# Altium project NXP_FRDM_IMX93.PrjPcb (part 2 of 13)

## Sheet E-05 LPDDR4_x.SchDoc: FRDM-IMX93
size 513 x 386 mm; DrawnBy: FORLINX; Organization: ORGANIZATION; Address1: ADDRESS 1; Address2: ADDRESS 2; Address3: ADDRESS 3; Address4: ADDRESS 4; Revision: -; ENG_APP_DATE: --/--/--; DSN_APP_DATE: --/--/--; CHK_APP_DATE: --/--/--; Classification: Public, Company Internal/Proprietary, Company Confidential,  Company Secret; Page Create Date: March  8, 1995; OrgName: NXP Semiconductor; FIUO: A; OrgAddr1: NO. 192 Liangjing Rd. Pudong New Area, ShangHai; Page Number: 5; PageTitle: LPDDR4/x; Page Size: C; Page Count: 23; Designer: FORLINX; RevCode: B1; Approver: NXP SE; Doc: SCH-94611 PDF: SPF-94611; DsnPath: T:\FILES\Designs\Single Board Computers\i.MX93-FRDM\Design Files\SCH-94611_B1.DSN; SchematicName: FRDM-i.MX 93 Development Board; PageName: E-05 LPDDR4/x; PageSize: C; TopSchematic: True
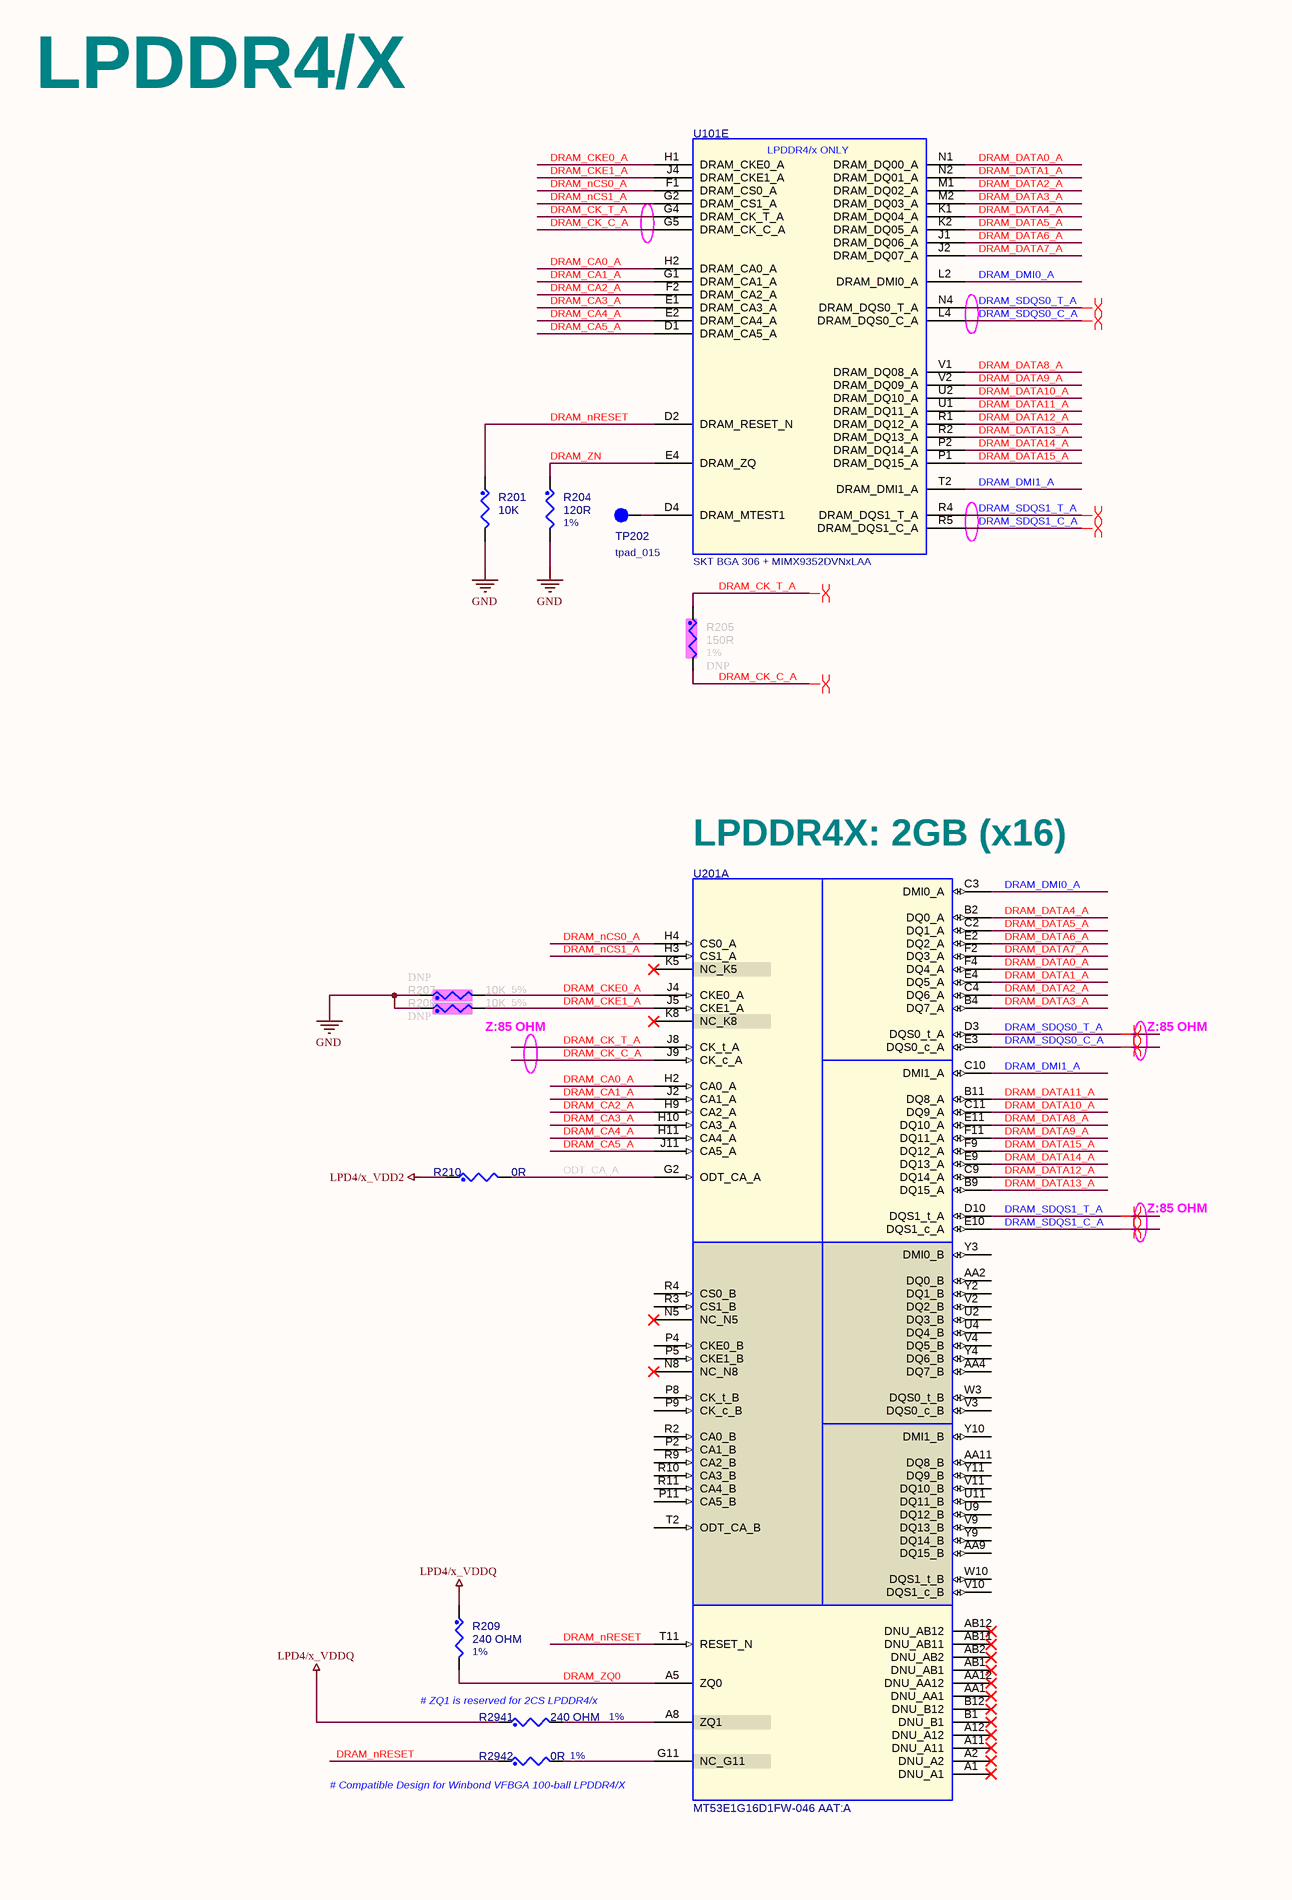
[diagram p9: E-05 LPDDR4_x.SchDoc, left]
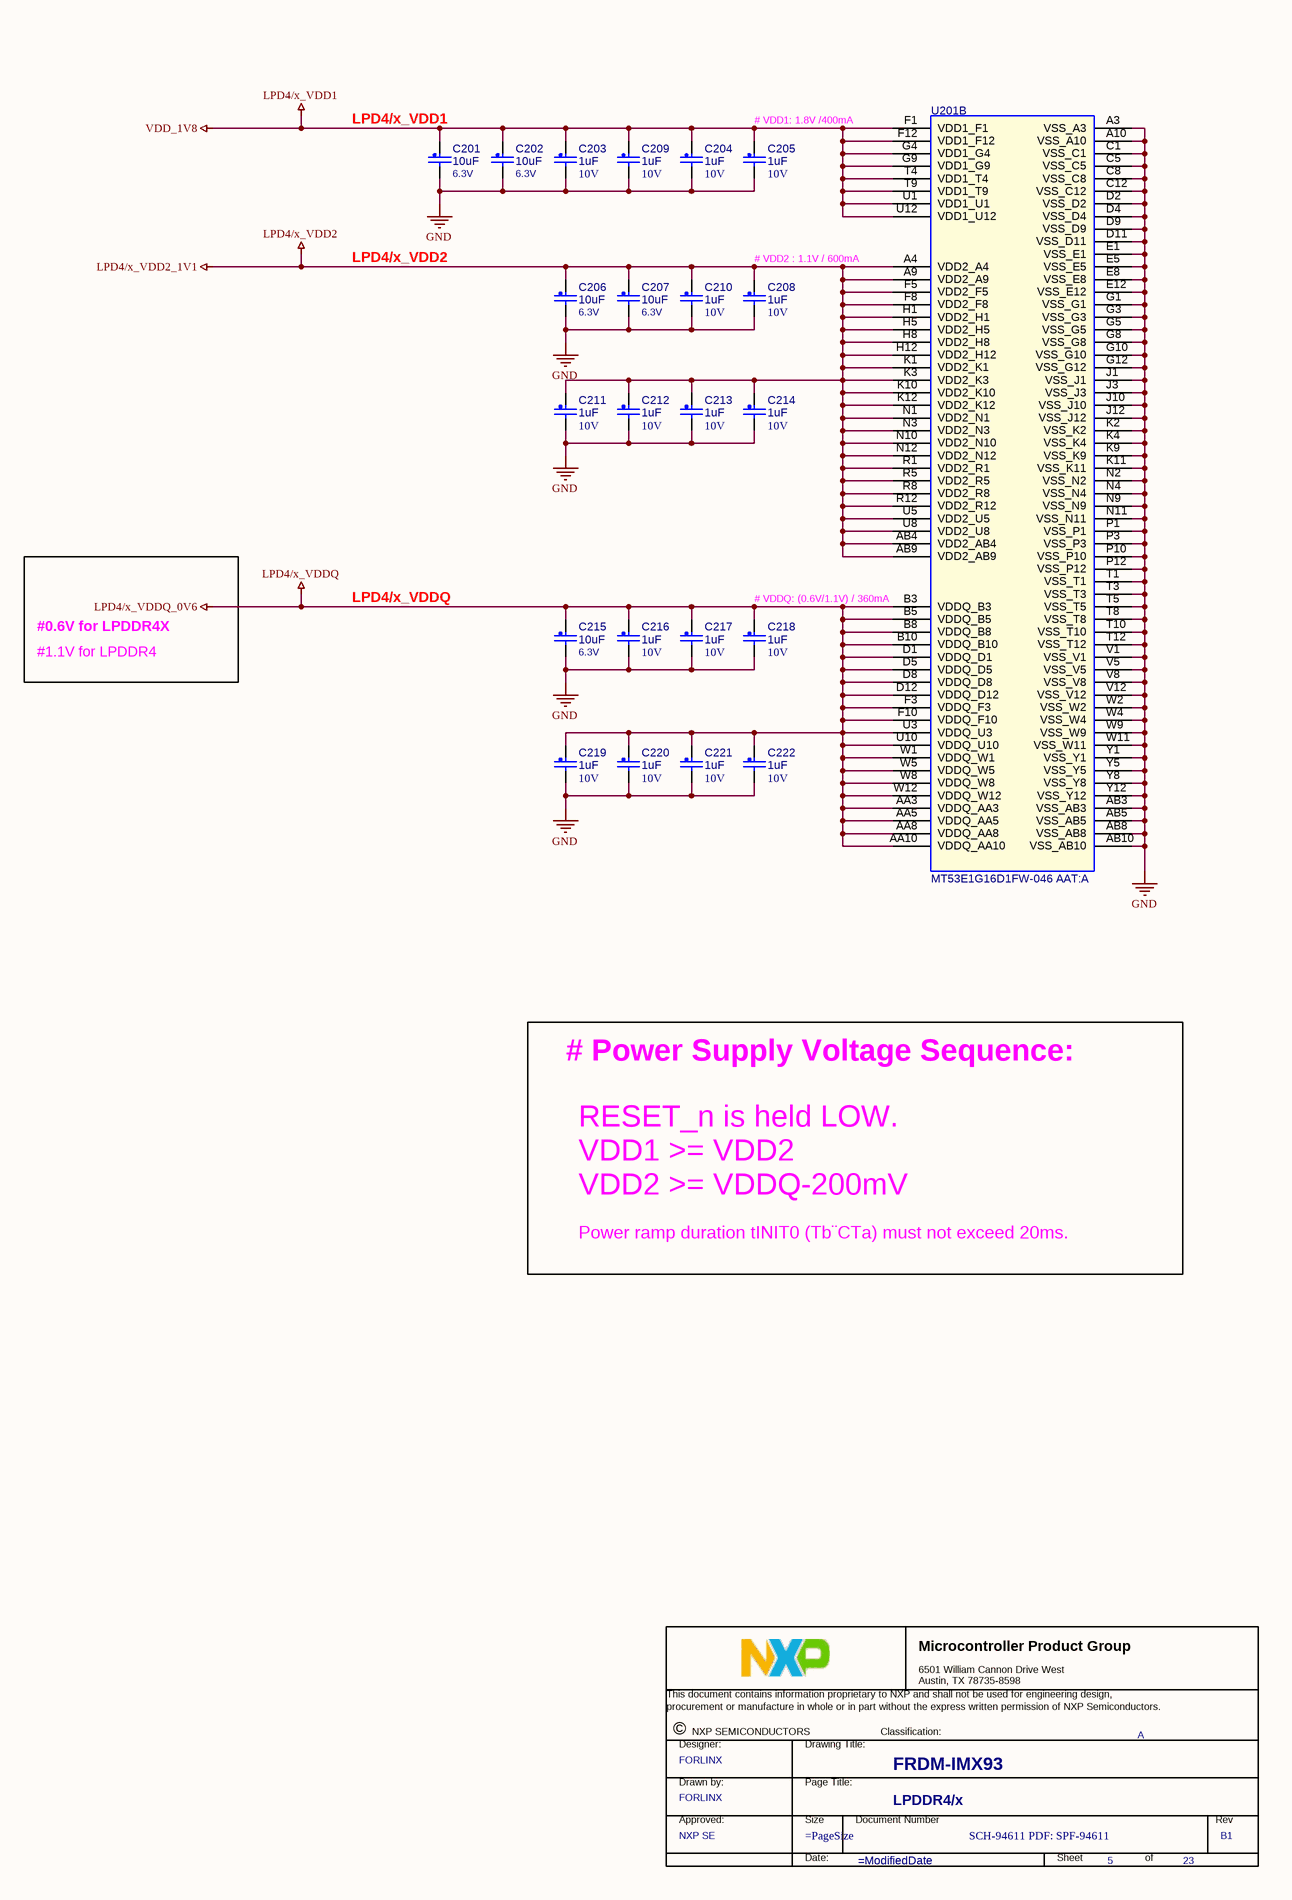
[diagram p10: E-05 LPDDR4_x.SchDoc, right]

### Parts
(Parts that share a designator on the sheet are numbered #1, #2 ... from top to bottom, then left to right.)
*#5  Title: FRDM-IMX93  RevCode: B1  PageTitle: LPDDR4/x  Page Number: 5  Page Count: 23  DrawnBy: FORLINX  Doc: SCH-94611 PDF: SPF-94611  Approver: NXP SE  FIUO: A  (graphical)
C201  10uF  VOLTAGE: 6.3V  [C0402]
C202  10uF  VOLTAGE: 6.3V  [C0402]
C203  1uF  VOLTAGE: 10V  [C0201]
C204  1uF  VOLTAGE: 10V  [C0201]
C205  1uF  VOLTAGE: 10V  [C0201]
C206  10uF  VOLTAGE: 6.3V  [C0402]
C207  10uF  VOLTAGE: 6.3V  [C0402]
C208  1uF  VOLTAGE: 10V  [C0201]
C209  1uF  VOLTAGE: 10V  [C0201]
C210  1uF  VOLTAGE: 10V  [C0201]
C211  1uF  VOLTAGE: 10V  [C0201]
C212  1uF  VOLTAGE: 10V  [C0201]
C213  1uF  VOLTAGE: 10V  [C0201]
C214  1uF  VOLTAGE: 10V  [C0201]
C215  10uF  VOLTAGE: 6.3V  [C0402]
C216  1uF  VOLTAGE: 10V  [C0201]
C217  1uF  VOLTAGE: 10V  [C0201]
C218  1uF  VOLTAGE: 10V  [C0201]
C219  1uF  VOLTAGE: 10V  [C0201]
C220  1uF  VOLTAGE: 10V  [C0201]
C221  1uF  VOLTAGE: 10V  [C0201]
C222  1uF  VOLTAGE: 10V  [C0201]
R201  10K  [R0402]
R204  120R  Tolerance: 1%  [R0402]
R205  150R  ASSY_OPT: DNP  Tolerance: 1%  [R0402]
R207  10K  ASSY_OPT: DNP  Tolerance: 5%  [R0402]
R208  10K  ASSY_OPT: DNP  Tolerance: 5%  [R0402]
R209  240 OHM  Tolerance: 1%  [R0201]
R210  0R  [R0402]
R2941  240 OHM  Tolerance: 1%  [R0201]
R2942  0R  Tolerance: 1%  [R0201]
TP202  TPAD_015  [tpad_015]
U101  SKT BGA 306 + MIMX9352DVNxLAA  [skt_bga306_0p5_sq16p23_elast_nsp]  (part E of 6)
U201  MT53E1G16D1FW-046 AAT:A  [bga200_0p65x0p8_10x14p5]  (parts A,B of 2)

### Nets
GND: C201.2 C202.2 C203.2 C204.2 C205.2 C206.2 C207.2 C208.2 C209.2 C210.2 C211.2 C212.2 C213.2 C214.2 C215.2 C216.2 C217.2 C218.2 C219.2 C220.2 C221.2 C222.2 R201.2 R204.2 R207.1 R208.1 U201.A3(VSS_A3) U201.A10(VSS_A10) U201.AB3(VSS_AB3) U201.AB5(VSS_AB5) U201.AB8(VSS_AB8) U201.AB10(VSS_AB10) U201.C1(VSS_C1) U201.C5(VSS_C5) U201.C8(VSS_C8) U201.C12(VSS_C12) U201.D2(VSS_D2) U201.D4(VSS_D4) U201.D9(VSS_D9) U201.D11(VSS_D11) U201.E1(VSS_E1) U201.E5(VSS_E5) U201.E8(VSS_E8) U201.E12(VSS_E12) U201.G1(VSS_G1) U201.G3(VSS_G3) U201.G5(VSS_G5) U201.G8(VSS_G8) U201.G10(VSS_G10) U201.G12(VSS_G12) U201.J1(VSS_J1) U201.J3(VSS_J3) U201.J10(VSS_J10) U201.J12(VSS_J12) U201.K2(VSS_K2) U201.K4(VSS_K4) U201.K9(VSS_K9) U201.K11(VSS_K11) U201.N2(VSS_N2) U201.N4(VSS_N4) U201.N9(VSS_N9) U201.N11(VSS_N11) U201.P1(VSS_P1) U201.P3(VSS_P3) U201.P10(VSS_P10) U201.P12(VSS_P12) U201.T1(VSS_T1) U201.T3(VSS_T3) U201.T5(VSS_T5) U201.T8(VSS_T8) U201.T10(VSS_T10) U201.T12(VSS_T12) U201.V1(VSS_V1) U201.V5(VSS_V5) U201.V8(VSS_V8) U201.V12(VSS_V12) U201.W2(VSS_W2) U201.W4(VSS_W4) U201.W9(VSS_W9) U201.W11(VSS_W11) U201.Y1(VSS_Y1) U201.Y5(VSS_Y5) U201.Y8(VSS_Y8) U201.Y12(VSS_Y12)
LPD4/x_VDD1: C201.1 C202.1 C203.1 C204.1 C205.1 C209.1 U201.F1(VDD1_F1) U201.F12(VDD1_F12) U201.G4(VDD1_G4) U201.G9(VDD1_G9) U201.T4(VDD1_T4) U201.T9(VDD1_T9) U201.U1(VDD1_U1) U201.U12(VDD1_U12)  [also labelled VDD_1V8]
LPD4/x_VDD2: C206.1 C207.1 C208.1 C210.1 C211.1 C212.1 C213.1 C214.1 R210.1 U201.A4(VDD2_A4) U201.A9(VDD2_A9) U201.AB4(VDD2_AB4) U201.AB9(VDD2_AB9) U201.F5(VDD2_F5) U201.F8(VDD2_F8) U201.H1(VDD2_H1) U201.H5(VDD2_H5) U201.H8(VDD2_H8) U201.H12(VDD2_H12) U201.K1(VDD2_K1) U201.K3(VDD2_K3) U201.K10(VDD2_K10) U201.K12(VDD2_K12) U201.N1(VDD2_N1) U201.N3(VDD2_N3) U201.N10(VDD2_N10) U201.N12(VDD2_N12) U201.R1(VDD2_R1) U201.R5(VDD2_R5) U201.R8(VDD2_R8) U201.R12(VDD2_R12) U201.U5(VDD2_U5) U201.U8(VDD2_U8)  [also labelled LPD4/x_VDD2_1V1]
LPD4/x_VDDQ: C215.1 C216.1 C217.1 C218.1 C219.1 C220.1 C221.1 C222.1 R209.1 R2941.1 U201.AA3(VDDQ_AA3) U201.AA5(VDDQ_AA5) U201.AA8(VDDQ_AA8) U201.AA10(VDDQ_AA10) U201.B3(VDDQ_B3) U201.B5(VDDQ_B5) U201.B8(VDDQ_B8) U201.B10(VDDQ_B10) U201.D1(VDDQ_D1) U201.D5(VDDQ_D5) U201.D8(VDDQ_D8) U201.D12(VDDQ_D12) U201.F3(VDDQ_F3) U201.F10(VDDQ_F10) U201.U3(VDDQ_U3) U201.U10(VDDQ_U10) U201.W1(VDDQ_W1) U201.W5(VDDQ_W5) U201.W8(VDDQ_W8) U201.W12(VDDQ_W12)  [also labelled LPD4/x_VDDQ_0V6]
DRAM_CA0_A: U101.H2(DRAM_CA0_A) U201.H2(CA0_A)
DRAM_CA1_A: U101.G1(DRAM_CA1_A) U201.J2(CA1_A)
DRAM_CA2_A: U101.F2(DRAM_CA2_A) U201.H9(CA2_A)
DRAM_CA3_A: U101.E1(DRAM_CA3_A) U201.H10(CA3_A)
DRAM_CA4_A: U101.E2(DRAM_CA4_A) U201.H11(CA4_A)
DRAM_CA5_A: U101.D1(DRAM_CA5_A) U201.J11(CA5_A)
DRAM_CK_C_A: R205.2 U101.G5(DRAM_CK_C_A) U201.J9(CK_c_A)
DRAM_CK_T_A: R205.1 U101.G4(DRAM_CK_T_A) U201.J8(CK_t_A)
DRAM_CKE0_A: R207.2 U101.H1(DRAM_CKE0_A) U201.J4(CKE0_A)
DRAM_CKE1_A: R208.2 U101.J4(DRAM_CKE1_A) U201.J5(CKE1_A)
DRAM_DATA0_A: U101.N1(DRAM_DQ00_A) U201.F4(DQ4_A)
DRAM_DATA1_A: U101.N2(DRAM_DQ01_A) U201.E4(DQ5_A)
DRAM_DATA2_A: U101.M1(DRAM_DQ02_A) U201.C4(DQ6_A)
DRAM_DATA3_A: U101.M2(DRAM_DQ03_A) U201.B4(DQ7_A)
DRAM_DATA4_A: U101.K1(DRAM_DQ04_A) U201.B2(DQ0_A)
DRAM_DATA5_A: U101.K2(DRAM_DQ05_A) U201.C2(DQ1_A)
DRAM_DATA6_A: U101.J1(DRAM_DQ06_A) U201.E2(DQ2_A)
DRAM_DATA7_A: U101.J2(DRAM_DQ07_A) U201.F2(DQ3_A)
DRAM_DATA8_A: U101.V1(DRAM_DQ08_A) U201.E11(DQ10_A)
DRAM_DATA9_A: U101.V2(DRAM_DQ09_A) U201.F11(DQ11_A)
DRAM_DATA10_A: U101.U2(DRAM_DQ10_A) U201.C11(DQ9_A)
DRAM_DATA11_A: U101.U1(DRAM_DQ11_A) U201.B11(DQ8_A)
DRAM_DATA12_A: U101.R1(DRAM_DQ12_A) U201.C9(DQ14_A)
DRAM_DATA13_A: U101.R2(DRAM_DQ13_A) U201.B9(DQ15_A)
DRAM_DATA14_A: U101.P2(DRAM_DQ14_A) U201.E9(DQ13_A)
DRAM_DATA15_A: U101.P1(DRAM_DQ15_A) U201.F9(DQ12_A)
DRAM_DMI0_A: U101.L2(DRAM_DMI0_A) U201.C3(DMI0_A)
DRAM_DMI1_A: U101.T2(DRAM_DMI1_A) U201.C10(DMI1_A)
DRAM_nCS0_A: U101.F1(DRAM_CS0_A) U201.H4(CS0_A)
DRAM_nCS1_A: U101.G2(DRAM_CS1_A) U201.H3(CS1_A)
DRAM_nRESET: R201.1 R2942.1 U101.D2(DRAM_RESET_N) U201.T11(RESET_N)
DRAM_SDQS0_C_A: U101.L4(DRAM_DQS0_C_A) U201.E3(DQS0_c_A)
DRAM_SDQS0_T_A: U101.N4(DRAM_DQS0_T_A) U201.D3(DQS0_t_A)
DRAM_SDQS1_C_A: U101.R5(DRAM_DQS1_C_A) U201.E10(DQS1_c_A)
DRAM_SDQS1_T_A: U101.R4(DRAM_DQS1_T_A) U201.D10(DQS1_t_A)
DRAM_ZN: R204.1 U101.E4(DRAM_ZQ)
DRAM_ZQ0: R209.2 U201.A5(ZQ0)
ODT_CA_A: R210.2 U201.G2(ODT_CA_A)
NetR2941_2: R2941.2 U201.A8(ZQ1)
NetR2942_2: R2942.2 U201.G11(NC_G11)
NetTP202_1: TP202.1(Pin1) U101.D4(DRAM_MTEST1)

Not connected (* = marked no-connect by the designer): U201 A1(DNU_A1)* A2(DNU_A2)* A11(DNU_A11)* A12(DNU_A12)* AA1(DNU_AA1)* AA2(DQ0_B) AA4(DQ7_B) AA9(DQ15_B) AA11(DQ8_B) AA12(DNU_AA12)* AB1(DNU_AB1)* AB2(DNU_AB2)* AB11(DNU_AB11)* AB12(DNU_AB12)* B1(DNU_B1)* B12(DNU_B12)* K5(NC_K5)* K8(NC_K8)* N5(NC_N5)* N8(NC_N8)* P2(CA1_B) P4(CKE0_B) P5(CKE1_B) P8(CK_t_B) P9(CK_c_B) P11(CA5_B) R2(CA0_B) R3(CS1_B) R4(CS0_B) R9(CA2_B) R10(CA3_B) R11(CA4_B) T2(ODT_CA_B) U2(DQ3_B) U4(DQ4_B) U9(DQ12_B) U11(DQ11_B) V2(DQ2_B) V3(DQS0_c_B) V4(DQ5_B) V9(DQ13_B) V10(DQS1_c_B) V11(DQ10_B) W3(DQS0_t_B) W10(DQS1_t_B) Y2(DQ1_B) Y3(DMI0_B) Y4(DQ6_B) Y9(DQ14_B) Y10(DMI1_B) Y11(DQ9_B)

### Layout directives
differential pair: DRAM_CK_C_A, DRAM_CK_T_A, DRAM_SDQS0_C_A, DRAM_SDQS0_T_A, DRAM_SDQS1_C_A, DRAM_SDQS1_T_A

### Notes on the sheet
- LPDDR4/X
- (near C205) # VDD1: 1.8V /400mA
- (near C208) # VDD2 : 1.1V / 600mA
- #0.6V for LPDDR4X
- # VDDQ: (0.6V/1.1V) / 360mA
- #1.1V for LPDDR4
- (near U201) LPDDR4X: 2GB (x16)
- Z:85 OHM
- # Power Supply Voltage Sequence:
- RESET_n is held LOW.
  VDD1 >= VDD2
  VDD2 >= VDDQ-200mV
- Power ramp duration tINIT0 (Tb¨CTa) must not exceed 20ms.
- (near R2941) # ZQ1 is reserved for 2CS LPDDR4/x
- (near R2942) # Compatible Design for Winbond VFBGA 100-ball LPDDR4/X
- DWG. NO.
- REV.
- SHT.
- REVISION
- DESCRIPTION
- DATE
- APPROVED
- ENG:
- APPROVALS
- quilter.ai <http://quilter.ai>
- DSN:
- CHK:
- REFERENCE DOCUMENTS
- TITLE
- PROJECT
- BOM:
- FAB DWG:
- PCB DWG:
- ASSY DWG:
- SIZE
- FILE NAME
- C
- DWG NO.
- SHEET
- OF
- REV
- (in symbol MIMX9352DVNxLAA, part E) LPDDR4/x ONLY
- (in symbol TitleBlock_MCPG) Microcontroller Product Group; 6501 William Cannon Drive West / Austin, TX 78735-8598; This document contains information proprietary to NXP and shall not be used for engineering design,; procurement or manufacture in whole or in part without the express written permission of NXP Semiconductors.; ©; NXP SEMICONDUCTORS; Classification:; Designer:; Drawing Title:; Drawn by:; Page Title:; Approved:; Size; Document Number; Rev; Date:; Sheet; of

### Library data of the parts
*#5 = TitleBlock_MCPG: Classification: Public, Company Internal/Proprietary, Company Confidential,  Company Secret; OrgName: NXP Semiconductor; OrgAddr1: NO. 192 Liangjing Rd. Pudong New Area, ShangHai; Page Size: =PageSize; Page Create Date: March  8, 1995; Designer: FORLINX; Page Modify Date: =ModifiedDate
C201 = CAP_NP: 0402,10uF,6.3V,+/-20%,X5R; Part Reference: C201; CLASS: DISCRETE; FPLIST: CC0402_25,CC0402_HD,0402_CC; CAD_APPROVED: Yes; MFG_PN01: 0402X106M6R3NT; MFG_NAME01: FENGHUA; Tolerance: 20%; Value: 10uF; PCB Footprint: C0402; HEIGHT: 0.65 MM; ROHS: Yes
C202 = CAP_NP: 0402,10uF,6.3V,+/-20%,X5R; Part Reference: C202; CLASS: DISCRETE; FPLIST: CC0402_25,CC0402_HD,0402_CC; CAD_APPROVED: Yes; MFG_PN01: 0402X106M6R3NT; MFG_NAME01: FENGHUA; Tolerance: 20%; Value: 10uF; PCB Footprint: C0402; HEIGHT: 0.65 MM; ROHS: Yes
C203 = CAP_NP: 0201,1uF,10V,+/-20%,X5R; Part Reference: C203; CLASS: DISCRETE; FPLIST: CC0201,CC0201_HD,0201_CC,cc_0201_cir; CAD_APPROVED: Yes; MFG_PN01: CL03A105MP3NSNC; MFG_NAME01: SAMSUNG; Tolerance: 10%; Temp Range: -55¡ãC to 85¡ãC; Value: 1uF; PCB Footprint: C0201; Package Type: SMD/SMT; Package Size: 0201 (0603 Metric); HEIGHT: 0.35MM; ROHS: Yes
C204 = CAP_NP: 0201,1uF,10V,+/-20%,X5R; Part Reference: C204; CLASS: DISCRETE; Tolerance: 10%; MFG_NAME01: SAMSUNG; MFG_PN01: CL03A105MP3NSNC; CAD_APPROVED: Yes; FPLIST: CC0201,CC0201_HD,0201_CC,cc_0201_cir; Temp Range: -55¡ãC to 85¡ãC; Value: 1uF; PCB Footprint: C0201; Package Type: SMD/SMT; Package Size: 0201 (0603 Metric); ROHS: Yes; HEIGHT: 0.35MM
C205 = CAP_NP: 0201,1uF,10V,+/-20%,X5R; Part Reference: C205; CLASS: DISCRETE; FPLIST: CC0201,CC0201_HD,0201_CC,cc_0201_cir; CAD_APPROVED: Yes; MFG_PN01: CL03A105MP3NSNC; MFG_NAME01: SAMSUNG; Tolerance: 10%; Temp Range: -55¡ãC to 85¡ãC; Value: 1uF; PCB Footprint: C0201; Package Type: SMD/SMT; Package Size: 0201 (0603 Metric); HEIGHT: 0.35MM; ROHS: Yes
C206 = CAP_NP: 0402,10uF,6.3V,+/-20%,X5R; Part Reference: C206; CLASS: DISCRETE; FPLIST: CC0402_25,CC0402_HD,0402_CC; CAD_APPROVED: Yes; MFG_PN01: 0402X106M6R3NT; MFG_NAME01: FENGHUA; Tolerance: 20%; Value: 10uF; PCB Footprint: C0402; HEIGHT: 0.65 MM; ROHS: Yes
C207 = CAP_NP: 0402,10uF,6.3V,+/-20%,X5R; Part Reference: C207; CLASS: DISCRETE; FPLIST: CC0402_25,CC0402_HD,0402_CC; CAD_APPROVED: Yes; MFG_PN01: 0402X106M6R3NT; MFG_NAME01: FENGHUA; Tolerance: 20%; Value: 10uF; PCB Footprint: C0402; HEIGHT: 0.65 MM; ROHS: Yes
C208 = CAP_NP: 0201,1uF,10V,+/-20%,X5R; Part Reference: C208; CLASS: DISCRETE; Tolerance: 10%; MFG_NAME01: SAMSUNG; MFG_PN01: CL03A105MP3NSNC; CAD_APPROVED: Yes; FPLIST: CC0201,CC0201_HD,0201_CC,cc_0201_cir; Temp Range: -55¡ãC to 85¡ãC; Value: 1uF; PCB Footprint: C0201; Package Type: SMD/SMT; Package Size: 0201 (0603 Metric); ROHS: Yes; HEIGHT: 0.35MM
C209 = CAP_NP: 0201,1uF,10V,+/-20%,X5R; Part Reference: C209; CLASS: DISCRETE; Tolerance: 10%; MFG_NAME01: SAMSUNG; MFG_PN01: CL03A105MP3NSNC; CAD_APPROVED: Yes; FPLIST: CC0201,CC0201_HD,0201_CC,cc_0201_cir; Temp Range: -55¡ãC to 85¡ãC; Value: 1uF; PCB Footprint: C0201; Package Type: SMD/SMT; Package Size: 0201 (0603 Metric); ROHS: Yes; HEIGHT: 0.35MM
C210 = CAP_NP: 0201,1uF,10V,+/-20%,X5R; Part Reference: C210; CLASS: DISCRETE; Tolerance: 10%; MFG_NAME01: SAMSUNG; MFG_PN01: CL03A105MP3NSNC; CAD_APPROVED: Yes; FPLIST: CC0201,CC0201_HD,0201_CC,cc_0201_cir; Temp Range: -55¡ãC to 85¡ãC; Value: 1uF; PCB Footprint: C0201; Package Type: SMD/SMT; Package Size: 0201 (0603 Metric); ROHS: Yes; HEIGHT: 0.35MM
C211 = CAP_NP: 0201,1uF,10V,+/-20%,X5R; Part Reference: C211; CLASS: DISCRETE; FPLIST: CC0201,CC0201_HD,0201_CC,cc_0201_cir; CAD_APPROVED: Yes; MFG_PN01: CL03A105MP3NSNC; MFG_NAME01: SAMSUNG; Tolerance: 10%; Temp Range: -55¡ãC to 85¡ãC; Value: 1uF; PCB Footprint: C0201; Package Type: SMD/SMT; Package Size: 0201 (0603 Metric); HEIGHT: 0.35MM; ROHS: Yes
C212 = CAP_NP: 0201,1uF,10V,+/-20%,X5R; Part Reference: C212; CLASS: DISCRETE; FPLIST: CC0201,CC0201_HD,0201_CC,cc_0201_cir; CAD_APPROVED: Yes; MFG_PN01: CL03A105MP3NSNC; MFG_NAME01: SAMSUNG; Tolerance: 10%; Temp Range: -55¡ãC to 85¡ãC; Value: 1uF; PCB Footprint: C0201; Package Type: SMD/SMT; Package Size: 0201 (0603 Metric); HEIGHT: 0.35MM; ROHS: Yes
C213 = CAP_NP: 0201,1uF,10V,+/-20%,X5R; Part Reference: C213; CLASS: DISCRETE; FPLIST: CC0201,CC0201_HD,0201_CC,cc_0201_cir; CAD_APPROVED: Yes; MFG_PN01: CL03A105MP3NSNC; MFG_NAME01: SAMSUNG; Tolerance: 10%; Temp Range: -55¡ãC to 85¡ãC; Value: 1uF; PCB Footprint: C0201; Package Type: SMD/SMT; Package Size: 0201 (0603 Metric); HEIGHT: 0.35MM; ROHS: Yes
C214 = CAP_NP: 0201,1uF,10V,+/-20%,X5R; Part Reference: C214; CLASS: DISCRETE; Tolerance: 10%; MFG_NAME01: SAMSUNG; MFG_PN01: CL03A105MP3NSNC; CAD_APPROVED: Yes; FPLIST: CC0201,CC0201_HD,0201_CC,cc_0201_cir; Temp Range: -55¡ãC to 85¡ãC; Value: 1uF; PCB Footprint: C0201; Package Type: SMD/SMT; Package Size: 0201 (0603 Metric); ROHS: Yes; HEIGHT: 0.35MM
C215 = CAP_NP: 0402,10uF,6.3V,+/-20%,X5R; Part Reference: C215; CLASS: DISCRETE; FPLIST: CC0402_25,CC0402_HD,0402_CC; CAD_APPROVED: Yes; MFG_PN01: 0402X106M6R3NT; MFG_NAME01: FENGHUA; Tolerance: 20%; Value: 10uF; PCB Footprint: C0402; HEIGHT: 0.65 MM; ROHS: Yes
C216 = CAP_NP: 0201,1uF,10V,+/-20%,X5R; Part Reference: C216; CLASS: DISCRETE; FPLIST: CC0201,CC0201_HD,0201_CC,cc_0201_cir; CAD_APPROVED: Yes; MFG_PN01: CL03A105MP3NSNC; MFG_NAME01: SAMSUNG; Tolerance: 10%; Temp Range: -55¡ãC to 85¡ãC; Value: 1uF; PCB Footprint: C0201; Package Type: SMD/SMT; Package Size: 0201 (0603 Metric); HEIGHT: 0.35MM; ROHS: Yes
C217 = CAP_NP: 0201,1uF,10V,+/-20%,X5R; Part Reference: C217; CLASS: DISCRETE; Tolerance: 10%; MFG_NAME01: SAMSUNG; MFG_PN01: CL03A105MP3NSNC; CAD_APPROVED: Yes; FPLIST: CC0201,CC0201_HD,0201_CC,cc_0201_cir; Temp Range: -55¡ãC to 85¡ãC; Value: 1uF; PCB Footprint: C0201; Package Type: SMD/SMT; Package Size: 0201 (0603 Metric); ROHS: Yes; HEIGHT: 0.35MM
C218 = CAP_NP: 0201,1uF,10V,+/-20%,X5R; Part Reference: C218; CLASS: DISCRETE; FPLIST: CC0201,CC0201_HD,0201_CC,cc_0201_cir; CAD_APPROVED: Yes; MFG_PN01: CL03A105MP3NSNC; MFG_NAME01: SAMSUNG; Tolerance: 10%; Temp Range: -55¡ãC to 85¡ãC; Value: 1uF; PCB Footprint: C0201; Package Type: SMD/SMT; Package Size: 0201 (0603 Metric); HEIGHT: 0.35MM; ROHS: Yes
C219 = CAP_NP: 0201,1uF,10V,+/-20%,X5R; Part Reference: C219; CLASS: DISCRETE; Tolerance: 10%; MFG_NAME01: SAMSUNG; MFG_PN01: CL03A105MP3NSNC; CAD_APPROVED: Yes; FPLIST: CC0201,CC0201_HD,0201_CC,cc_0201_cir; Temp Range: -55¡ãC to 85¡ãC; Value: 1uF; PCB Footprint: C0201; ROHS: Yes; HEIGHT: 0.35MM; Package Size: 0201 (0603 Metric); Package Type: SMD/SMT
C220 = CAP_NP: 0201,1uF,10V,+/-20%,X5R; Part Reference: C220; CLASS: DISCRETE; FPLIST: CC0201,CC0201_HD,0201_CC,cc_0201_cir; CAD_APPROVED: Yes; MFG_PN01: CL03A105MP3NSNC; MFG_NAME01: SAMSUNG; Tolerance: 10%; Temp Range: -55¡ãC to 85¡ãC; Value: 1uF; PCB Footprint: C0201; HEIGHT: 0.35MM; ROHS: Yes; Package Size: 0201 (0603 Metric); Package Type: SMD/SMT
C221 = CAP_NP: 0201,1uF,10V,+/-20%,X5R; Part Reference: C221; CLASS: DISCRETE; Tolerance: 10%; MFG_NAME01: SAMSUNG; MFG_PN01: CL03A105MP3NSNC; CAD_APPROVED: Yes; FPLIST: CC0201,CC0201_HD,0201_CC,cc_0201_cir; Temp Range: -55¡ãC to 85¡ãC; Value: 1uF; PCB Footprint: C0201; ROHS: Yes; HEIGHT: 0.35MM; Package Size: 0201 (0603 Metric); Package Type: SMD/SMT
C222 = CAP_NP: 0201,1uF,10V,+/-20%,X5R; Part Reference: C222; CLASS: DISCRETE; FPLIST: CC0201,CC0201_HD,0201_CC,cc_0201_cir; CAD_APPROVED: Yes; MFG_PN01: CL03A105MP3NSNC; MFG_NAME01: SAMSUNG; Tolerance: 10%; Temp Range: -55¡ãC to 85¡ãC; Value: 1uF; PCB Footprint: C0201; HEIGHT: 0.35MM; ROHS: Yes; Package Size: 0201 (0603 Metric); Package Type: SMD/SMT
R201 = RES: 0402,10K,+/-1%; Part Reference: R201; CLASS: DISCRETE; FPLIST: RC0402_25,RC0402_HD,0402_CC; CAD_APPROVED: Yes; MFG_PN01: RC-02W1002FT; MFG_NAME01: FENGHUA; Tolerance: 5%; Value: 10K; PCB Footprint: R0402; HEIGHT: 0.4 MM; ROHS: Yes
R204 = RES: 0402,120Ohm,+/-1%; Part Reference: R204; CLASS: DISCRETE; FPLIST: RC0402_25,RC0402_HD,0402_CC; CAD_APPROVED: Yes; VOLTAGE: 1/10W; Temp Range: -55¡ãC ~ 155¡ãC; MFG_NAME01: FENGHUA; MFG_PN01: RC-02K1200FT; Value: 120R; PCB Footprint: R0402; HEIGHT: 0.4MM; ROHS: Yes
R205 = RES: 0402,150Ohm,+/-5%; Part Reference: R205; CLASS: DISCRETE; FPLIST: RC0402_25,RC0402_HD,0402_CC; CAD_APPROVED: Yes; MFG_PN01: RC-02W151JT; MFG_NAME01: FENGHUA; Value: 150R; PCB Footprint: R0402; HEIGHT: 0.4MM; ROHS: Yes
R207 = RES: 0402,10K,+/-1%; Part Reference: R207; CLASS: DISCRETE; FPLIST: RC0402_25,RC0402_HD,0402_CC; CAD_APPROVED: Yes; MFG_PN01: RC-02W1002FT; MFG_NAME01: FENGHUA; Value: 10K; PCB Footprint: R0402; ROHS: Yes; HEIGHT: 0.4 MM
R208 = RES: 0402,10K,+/-1%; Part Reference: R208; CLASS: DISCRETE; MFG_NAME01: FENGHUA; MFG_PN01: RC-02W1002FT; CAD_APPROVED: Yes; FPLIST: RC0402_25,RC0402_HD,0402_CC; Value: 10K; PCB Footprint: R0402; HEIGHT: 0.4 MM; ROHS: Yes
R209 = RES: 0201,240Ohm,+/-1%; Part Reference: R209; CLASS: DISCRETE; Temp Range: -55¡ãC ~ 125¡ãC; VOLTAGE: 25V; FPLIST: CC0201,CC0201_HD,0201_CC; CAD_APPROVED: Yes; MFG_PN01: RC-01W2400FT; MFG_NAME01: FENGHUA; Value: 240 OHM; PCB Footprint: R0201; HEIGHT: 0.26MM; Temp_Range: -55¡ãC ~ 125¡ãC; ROHS: Yes
R210 = RES: 0402,0Ohm,+/-1%; Part Reference: R210; CLASS: DISCRETE; VOLTAGE: 1/16W; Tolerance: 5%; MFG_NAME01: FENGHUA; MFG_PN01: RC-02000FT; CAD_APPROVED: Yes; FPLIST: RC0402_25,RC0402_HD,RC0402_X2,0402_CC; Value: 0R; PCB Footprint: R0402; ROHS: Yes; HEIGHT: 0.45 MM
R2941 = RES: 0201,240Ohm,+/-1%; Part Reference: R2941; CLASS: DISCRETE; MFG_NAME01: FENGHUA; MFG_PN01: RC-01W2400FT; Temp_Range: -55¡ãC ~ 125¡ãC; CAD_APPROVED: Yes; FPLIST: CC0201,CC0201_HD,0201_CC; VOLTAGE: 25V; Value: 240 OHM; PCB Footprint: R0201; ROHS: Yes; HEIGHT: 0.26MM; Temp Range: -55¡ãC ~ 125¡ãC
R2942 = RES: 0201,0Ohm,+/-5%; Part Reference: R2942; CLASS: DISCRETE; MFG_NAME01: FENGHUA; MFG_PN01: RC-01000JT; Temp_Range: -55¡ãC ~ 125¡ãC; CAD_APPROVED: Yes; FPLIST: CC0201,CC0201_HD,0201_CC; VOLTAGE: 25V; Value: 0R; PCB Footprint: R0201; ROHS: Yes; HEIGHT: 0.26MM; Temp Range: -55¡ãC ~ 125¡ãC
TP202 = TESTLOOP: no part to order; Part Reference: TP202; CLASS: IO; ASSY_OPT: DNP; CAD_APPROVED: Yes; MFG_PN01: NOT A COMPONENT; PCB Footprint: tpad_015; HEIGHT: 0.1MM; ROHS: Yes; MFG_NAME01: NOT A COMPONENT
U101 = MIMX9352DVNxLAA: MIMX9352CVVXMAB,-40~105+C,11*11mm,0.5mm pitch,FCBGA,A,306pin,1.7GHz; Part Reference: U101; CLASS: IC; FPLIST: skt_bga306_0p5_sq16p23_elast,skt_bga306_0p5_sq16p23_elast_nsp; CAD_APPROVED: Yes; MFG_NAME01: NXP SEMICONDUCTORS; Value: SKT BGA 306 + MIMX9352DVNxLAA; PCB Footprint: skt_bga306_0p5_sq16p23_elast_nsp; HEIGHT: 10.03MM; ROHS: Yes; MFG_PN01: MIMX9352DVNxLAA
U201 = MT53B768M32D4NQ_200P: MT53E1G16D1ZW-046 WT:C,200-ball TFBGA,10x14.5,LPDDR4/LPDDR4x,2GB,-25+C~85+C,code:D8FCP; Part Reference: U201; CLASS: IC; SPLIT_INST: TRUE; SWAP_INFO: (S1+S2); MFG_NAME01: MICRON; Temp_Range: -40C to +105C¡ãC; PRE_APN: 334-77894; CAD_APPROVED: Yes; VOLTAGE: 1.1V; Value: MT53E1G16D1FW-046 AAT:A; MFG_PN01: MT53E1G16D1ZW-046 WT:C; ROHS: Yes; HEIGHT: 0.95MM; Temp Range: -40C to +105C¡ãC; PCB Footprint: bga200_0p65x0p8_10x14p5

## Sheet E-06 CPU IO_PHY.SchDoc: FRDM-IMX93
size 513 x 386 mm; DrawnBy: FORLINX; Organization: ORGANIZATION; Address1: ADDRESS 1; Address2: ADDRESS 2; Address3: ADDRESS 3; Address4: ADDRESS 4; Revision: -; ENG_APP_DATE: --/--/--; DSN_APP_DATE: --/--/--; CHK_APP_DATE: --/--/--; Classification: Public, Company Internal/Proprietary, Company Confidential,  Company Secret; Page Create Date: March  8, 1995; OrgName: NXP Semiconductor; FIUO: A; OrgAddr1: NO. 192 Liangjing Rd. Pudong New Area, ShangHai; Page Number: 6; PageTitle: CPU IO/PHY; Page Size: C; Page Count: 23; Designer: FORLINX; RevCode: B1; Approver: NXP SE; Doc: SCH-94611 PDF: SPF-94611; DsnPath: T:\FILES\Designs\Single Board Computers\i.MX93-FRDM\Design Files\SCH-94611_B1.DSN; SchematicName: FRDM-i.MX 93 Development Board; PageName: E-06 CPU IO/PHY; PageSize: C; TopSchematic: True
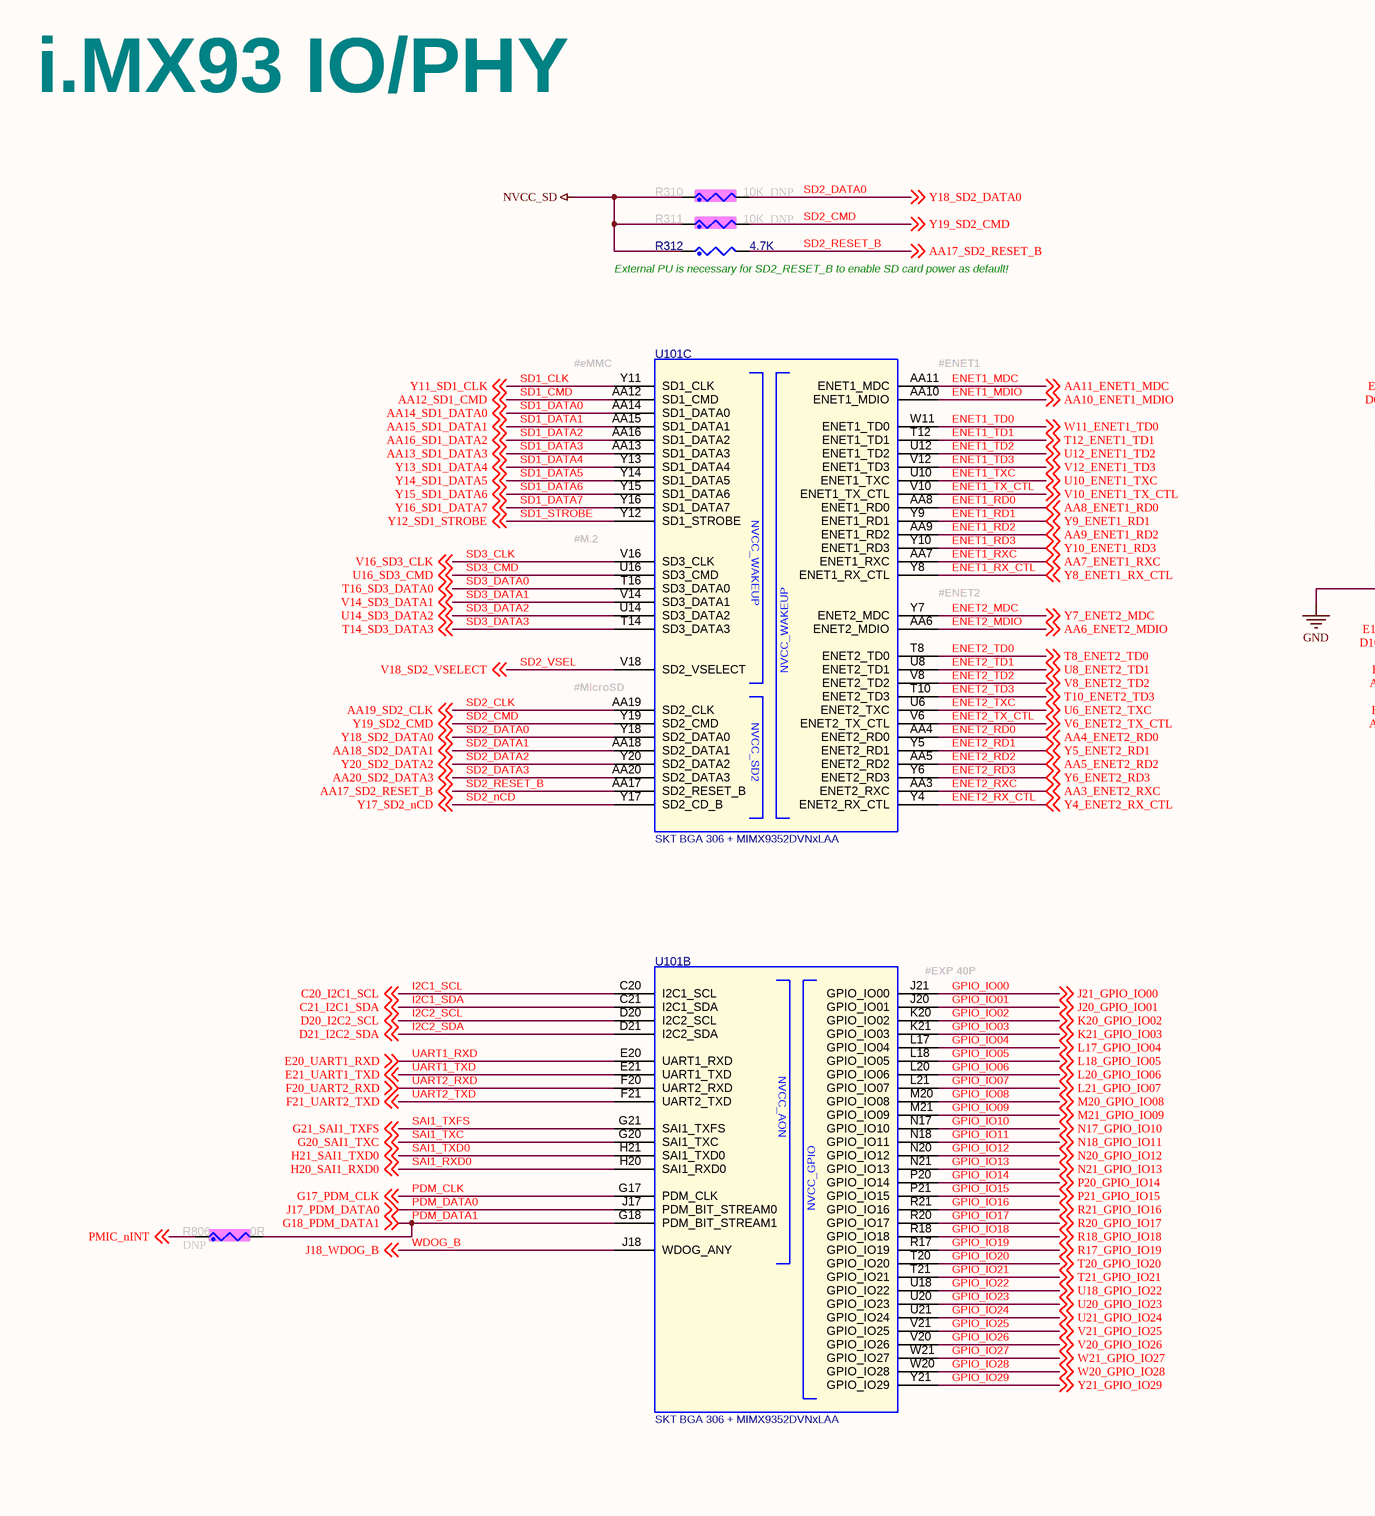
[diagram p11: E-06 CPU IO_PHY.SchDoc, left]
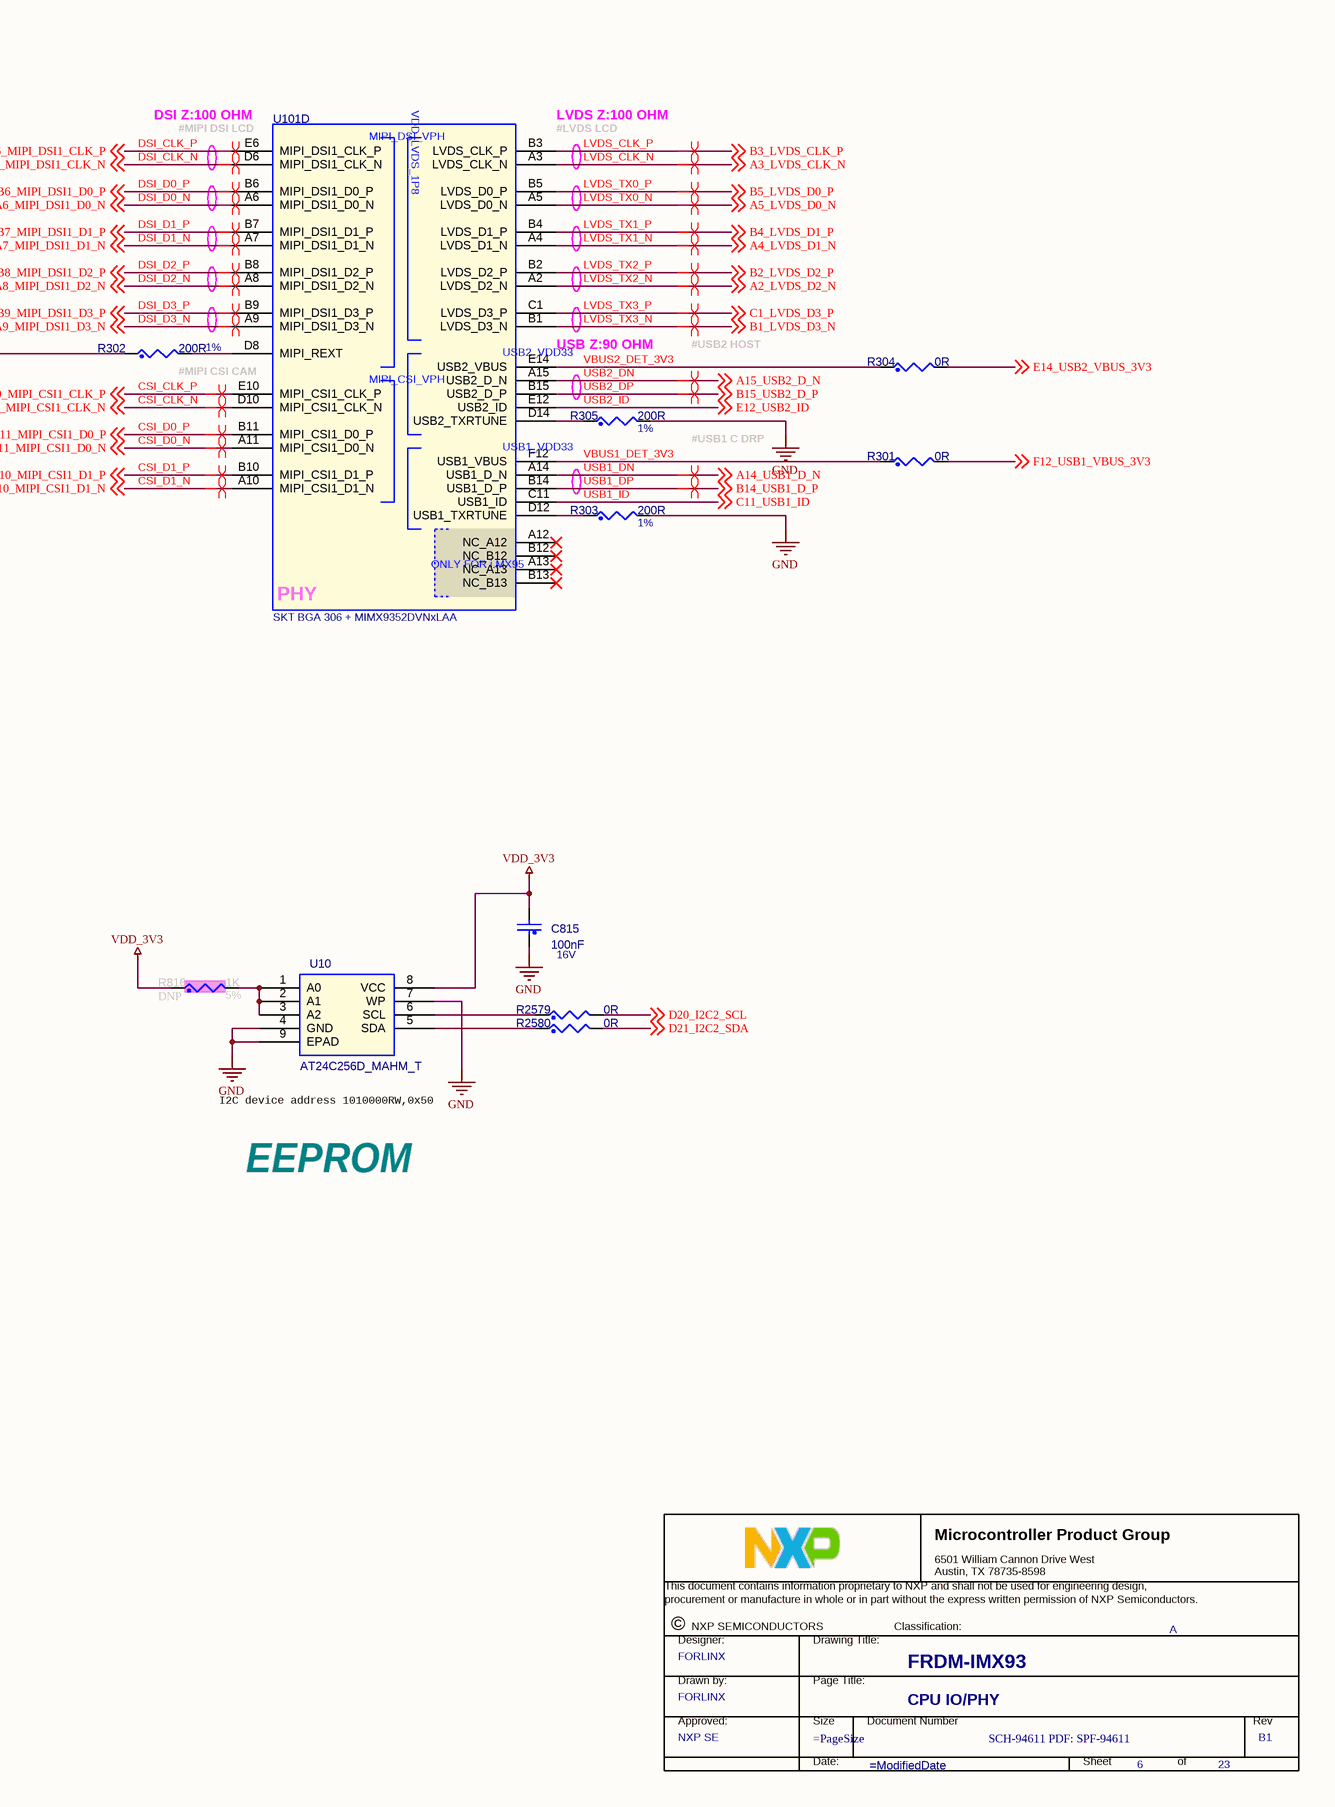
[diagram p12: E-06 CPU IO_PHY.SchDoc, right]

### Parts
(Parts that share a designator on the sheet are numbered #1, #2 ... from top to bottom, then left to right.)
*#6  Title: FRDM-IMX93  RevCode: B1  PageTitle: CPU IO/PHY  Page Number: 6  Page Count: 23  DrawnBy: FORLINX  Doc: SCH-94611 PDF: SPF-94611  Approver: NXP SE  FIUO: A  (graphical)
C815  100nF  VOLTAGE: 16V  [C0402]
R301  0R  [R0201]
R302  200R  Tolerance: 1%  [R0201]
R303  200R  Tolerance: 1%  [R0201]
R304  0R  [R0201]
R305  200R  Tolerance: 1%  [R0201]
R310  10K  ASSY_OPT: DNP  [R0402]
R311  10K  ASSY_OPT: DNP  [R0402]
R312  4.7K  [R0402]
R806  0R  ASSY_OPT: DNP  [R0201]
R816  1K  ASSY_OPT: DNP  Tolerance: 5%  [R0402]
R2579  0R  [R0402]
R2580  0R  [R0402]
U10  AT24C256D_MAHM_T  [UDFN-8P]
U101  SKT BGA 306 + MIMX9352DVNxLAA  [skt_bga306_0p5_sq16p23_elast_nsp]  (parts B,C,D of 6)

### Nets
GND: C815.1 R302.1 R303.2 R305.2 U10.4(GND) U10.7(WP) U10.9(EPAD)
NVCC_SD: R310.1 R311.1 R312.1
VDD_3V3: C815.2 R816.1 U10.8(VCC)
A14_USB1_D_N: U101.A14(USB1_D_N) ; off-sheet A14_USB1_D_N  [also labelled USB1_DN]  [project net USB1_DM]
AA3_ENET2_RXC: U101.AA3(ENET2_RXC) ; off-sheet AA3_ENET2_RXC  [also labelled ENET2_RXC]  [project net ENET2_PHYAD1]
AA5_ENET2_RD2: U101.AA5(ENET2_RD2) ; off-sheet AA5_ENET2_RD2  [also labelled ENET2_RD2]  [project net ENET2_MODE1]
AA7_ENET1_RXC: U101.AA7(ENET1_RXC) ; off-sheet AA7_ENET1_RXC  [also labelled ENET1_RXC]  [project net ENET1_PHYAD1]
AA9_ENET1_RD2: U101.AA9(ENET1_RD2) ; off-sheet AA9_ENET1_RD2  [also labelled ENET1_RD2]  [project net ENET1_MODE1]
CSI_CLK_N: U101.D10(MIPI_CSI1_CLK_N) ; off-sheet D10_MIPI_CSI1_CLK_N  [also labelled D10_MIPI_CSI1_CLK_N]
CSI_CLK_P: U101.E10(MIPI_CSI1_CLK_P) ; off-sheet E10_MIPI_CSI1_CLK_P  [also labelled E10_MIPI_CSI1_CLK_P]
CSI_D0_N: U101.A11(MIPI_CSI1_D0_N) ; off-sheet A11_MIPI_CSI1_D0_N  [also labelled A11_MIPI_CSI1_D0_N]
CSI_D0_P: U101.B11(MIPI_CSI1_D0_P) ; off-sheet B11_MIPI_CSI1_D0_P  [also labelled B11_MIPI_CSI1_D0_P]
CSI_D1_N: U101.A10(MIPI_CSI1_D1_N) ; off-sheet A10_MIPI_CSI1_D1_N  [also labelled A10_MIPI_CSI1_D1_N]
CSI_D1_P: U101.B10(MIPI_CSI1_D1_P) ; off-sheet B10_MIPI_CSI1_D1_P  [also labelled B10_MIPI_CSI1_D1_P]
DSI_CLK_N: U101.D6(MIPI_DSI1_CLK_N) ; off-sheet D6_MIPI_DSI1_CLK_N  [also labelled D6_MIPI_DSI1_CLK_N]
DSI_CLK_P: U101.E6(MIPI_DSI1_CLK_P) ; off-sheet E6_MIPI_DSI1_CLK_P  [also labelled E6_MIPI_DSI1_CLK_P]
DSI_D0_N: U101.A6(MIPI_DSI1_D0_N) ; off-sheet A6_MIPI_DSI1_D0_N  [also labelled A6_MIPI_DSI1_D0_N]
DSI_D0_P: U101.B6(MIPI_DSI1_D0_P) ; off-sheet B6_MIPI_DSI1_D0_P  [also labelled B6_MIPI_DSI1_D0_P]
DSI_D1_N: U101.A7(MIPI_DSI1_D1_N) ; off-sheet A7_MIPI_DSI1_D1_N  [also labelled A7_MIPI_DSI1_D1_N]
DSI_D1_P: U101.B7(MIPI_DSI1_D1_P) ; off-sheet B7_MIPI_DSI1_D1_P  [also labelled B7_MIPI_DSI1_D1_P]
DSI_D2_N: U101.A8(MIPI_DSI1_D2_N) ; off-sheet A8_MIPI_DSI1_D2_N  [also labelled A8_MIPI_DSI1_D2_N]
DSI_D2_P: U101.B8(MIPI_DSI1_D2_P) ; off-sheet B8_MIPI_DSI1_D2_P  [also labelled B8_MIPI_DSI1_D2_P]
DSI_D3_N: U101.A9(MIPI_DSI1_D3_N) ; off-sheet A9_MIPI_DSI1_D3_N  [also labelled A9_MIPI_DSI1_D3_N]
DSI_D3_P: U101.B9(MIPI_DSI1_D3_P) ; off-sheet B9_MIPI_DSI1_D3_P  [also labelled B9_MIPI_DSI1_D3_P]
E14_USB2_VBUS_3V3: R304.2 ; off-sheet E14_USB2_VBUS_3V3
E21_UART1_TXD: U101.E21(UART1_TXD) ; off-sheet E21_UART1_TXD  [also labelled UART1_TXD]  [project net #BOOT_MODE0]
ENET1_MDC: U101.AA11(ENET1_MDC) ; off-sheet AA11_ENET1_MDC  [also labelled AA11_ENET1_MDC]
ENET1_MDIO: U101.AA10(ENET1_MDIO) ; off-sheet AA10_ENET1_MDIO  [also labelled AA10_ENET1_MDIO]
ENET1_RD0: U101.AA8(ENET1_RD0) ; off-sheet AA8_ENET1_RD0  [also labelled AA8_ENET1_RD0]
ENET1_RD1: U101.Y9(ENET1_RD1) ; off-sheet Y9_ENET1_RD1  [also labelled Y9_ENET1_RD1]  [project net ENET1_MODE0]
ENET1_RD3: U101.Y10(ENET1_RD3) ; off-sheet Y10_ENET1_RD3  [also labelled Y10_ENET1_RD3]  [project net ENET1_MODE2]
ENET1_RX_CTL: U101.Y8(ENET1_RX_CTL) ; off-sheet Y8_ENET1_RX_CTL  [also labelled Y8_ENET1_RX_CTL]  [project net ENET1_PHYAD2]
ENET1_TD0: U101.W11(ENET1_TD0) ; off-sheet W11_ENET1_TD0  [also labelled W11_ENET1_TD0]
ENET1_TD1: U101.T12(ENET1_TD1) ; off-sheet T12_ENET1_TD1  [also labelled T12_ENET1_TD1]
ENET1_TD2: U101.U12(ENET1_TD2) ; off-sheet U12_ENET1_TD2  [also labelled U12_ENET1_TD2]
ENET1_TD3: U101.V12(ENET1_TD3) ; off-sheet V12_ENET1_TD3  [also labelled V12_ENET1_TD3]
ENET1_TX_CTL: U101.V10(ENET1_TX_CTL) ; off-sheet V10_ENET1_TX_CTL  [also labelled V10_ENET1_TX_CTL]
ENET1_TXC: U101.U10(ENET1_TXC) ; off-sheet U10_ENET1_TXC  [also labelled U10_ENET1_TXC]
ENET2_MDC: U101.Y7(ENET2_MDC) ; off-sheet Y7_ENET2_MDC  [also labelled Y7_ENET2_MDC]
ENET2_MDIO: U101.AA6(ENET2_MDIO) ; off-sheet AA6_ENET2_MDIO  [also labelled AA6_ENET2_MDIO]
ENET2_RD0: U101.AA4(ENET2_RD0) ; off-sheet AA4_ENET2_RD0  [also labelled AA4_ENET2_RD0]
ENET2_RD1: U101.Y5(ENET2_RD1) ; off-sheet Y5_ENET2_RD1  [also labelled Y5_ENET2_RD1]  [project net ENET2_MODE0]
ENET2_RD3: U101.Y6(ENET2_RD3) ; off-sheet Y6_ENET2_RD3  [also labelled Y6_ENET2_RD3]  [project net ENET2_MODE2]
ENET2_RX_CTL: U101.Y4(ENET2_RX_CTL) ; off-sheet Y4_ENET2_RX_CTL  [also labelled Y4_ENET2_RX_CTL]  [project net ENET2_PHYAD2]
ENET2_TD0: U101.T8(ENET2_TD0) ; off-sheet T8_ENET2_TD0  [also labelled T8_ENET2_TD0]
ENET2_TD1: U101.U8(ENET2_TD1) ; off-sheet U8_ENET2_TD1  [also labelled U8_ENET2_TD1]
ENET2_TD2: U101.V8(ENET2_TD2) ; off-sheet V8_ENET2_TD2  [also labelled V8_ENET2_TD2]
ENET2_TD3: U101.T10(ENET2_TD3) ; off-sheet T10_ENET2_TD3  [also labelled T10_ENET2_TD3]
ENET2_TX_CTL: U101.V6(ENET2_TX_CTL) ; off-sheet V6_ENET2_TX_CTL  [also labelled V6_ENET2_TX_CTL]
ENET2_TXC: U101.U6(ENET2_TXC) ; off-sheet U6_ENET2_TXC  [also labelled U6_ENET2_TXC]
F12_USB1_VBUS_3V3: R301.2 ; off-sheet F12_USB1_VBUS_3V3
F21_UART2_TXD: U101.F21(UART2_TXD) ; off-sheet F21_UART2_TXD  [also labelled UART2_TXD]  [project net #BOOT_MODE1]
G21_SAI1_TXFS: U101.G21(SAI1_TXFS) ; off-sheet G21_SAI1_TXFS  [also labelled SAI1_TXFS]  [project net #BOOT_MODE2]
GPIO_IO00: U101.J21(GPIO_IO00) ; off-sheet J21_GPIO_IO00  [also labelled J21_GPIO_IO00]  [project net EXP_GPIO_IO00]
GPIO_IO01: U101.J20(GPIO_IO01) ; off-sheet J20_GPIO_IO01  [also labelled J20_GPIO_IO01]  [project net EXP_GPIO_IO01]
GPIO_IO02: U101.K20(GPIO_IO02) ; off-sheet K20_GPIO_IO02  [also labelled K20_GPIO_IO02]
GPIO_IO03: U101.K21(GPIO_IO03) ; off-sheet K21_GPIO_IO03  [also labelled K21_GPIO_IO03]
GPIO_IO04: U101.L17(GPIO_IO04) ; off-sheet L17_GPIO_IO04  [also labelled L17_GPIO_IO04]  [project net EXP_GPIO_IO04]
GPIO_IO05: U101.L18(GPIO_IO05) ; off-sheet L18_GPIO_IO05  [also labelled L18_GPIO_IO05]  [project net EXP_GPIO_IO05]
GPIO_IO06: U101.L20(GPIO_IO06) ; off-sheet L20_GPIO_IO06  [also labelled L20_GPIO_IO06]  [project net EXP_GPIO_IO06]
GPIO_IO07: U101.L21(GPIO_IO07) ; off-sheet L21_GPIO_IO07  [also labelled L21_GPIO_IO07]  [project net EXP_GPIO_IO07]
GPIO_IO08: U101.M20(GPIO_IO08) ; off-sheet M20_GPIO_IO08  [also labelled M20_GPIO_IO08]
GPIO_IO09: U101.M21(GPIO_IO09) ; off-sheet M21_GPIO_IO09  [also labelled M21_GPIO_IO09]
GPIO_IO10: U101.N17(GPIO_IO10) ; off-sheet N17_GPIO_IO10  [also labelled N17_GPIO_IO10]
GPIO_IO11: U101.N18(GPIO_IO11) ; off-sheet N18_GPIO_IO11  [also labelled N18_GPIO_IO11]
GPIO_IO12: U101.N20(GPIO_IO12) ; off-sheet N20_GPIO_IO12  [also labelled N20_GPIO_IO12]  [project net EXP_GPIO_IO12]
GPIO_IO13: U101.N21(GPIO_IO13) ; off-sheet N21_GPIO_IO13  [also labelled N21_GPIO_IO13]  [project net EXP_GPIO_IO13]
GPIO_IO14: U101.P20(GPIO_IO14) ; off-sheet P20_GPIO_IO14  [also labelled P20_GPIO_IO14]  [project net EXP_GPIO_IO14]
GPIO_IO15: U101.P21(GPIO_IO15) ; off-sheet P21_GPIO_IO15  [also labelled P21_GPIO_IO15]  [project net EXP_GPIO_IO15]
GPIO_IO16: U101.R21(GPIO_IO16) ; off-sheet R21_GPIO_IO16  [also labelled R21_GPIO_IO16]  [project net EXP_GPIO_IO16]
GPIO_IO17: U101.R20(GPIO_IO17) ; off-sheet R20_GPIO_IO17  [also labelled R20_GPIO_IO17]  [project net EXP_GPIO_IO17]
GPIO_IO18: U101.R18(GPIO_IO18) ; off-sheet R18_GPIO_IO18  [also labelled R18_GPIO_IO18]  [project net EXP_GPIO_IO18]
GPIO_IO19: U101.R17(GPIO_IO19) ; off-sheet R17_GPIO_IO19  [also labelled R17_GPIO_IO19]  [project net EXP_GPIO_IO19]
GPIO_IO20: U101.T20(GPIO_IO20) ; off-sheet T20_GPIO_IO20  [also labelled T20_GPIO_IO20]  [project net EXP_GPIO_IO20]
GPIO_IO21: U101.T21(GPIO_IO21) ; off-sheet T21_GPIO_IO21  [also labelled T21_GPIO_IO21]  [project net EXP_GPIO_IO21]
GPIO_IO22: U101.U18(GPIO_IO22) ; off-sheet U18_GPIO_IO22  [also labelled U18_GPIO_IO22]  [project net EXP_GPIO_IO22]
GPIO_IO23: U101.U20(GPIO_IO23) ; off-sheet U20_GPIO_IO23  [also labelled U20_GPIO_IO23]  [project net EXP_GPIO_IO23]
GPIO_IO24: U101.U21(GPIO_IO24) ; off-sheet U21_GPIO_IO24  [also labelled U21_GPIO_IO24]  [project net EXP_GPIO_IO24]
GPIO_IO25: U101.V21(GPIO_IO25) ; off-sheet V21_GPIO_IO25  [also labelled V21_GPIO_IO25]  [project net EXP_GPIO_IO25]
GPIO_IO26: U101.V20(GPIO_IO26) ; off-sheet V20_GPIO_IO26  [also labelled V20_GPIO_IO26]  [project net EXP_GPIO_IO26]
GPIO_IO27: U101.W21(GPIO_IO27) ; off-sheet W21_GPIO_IO27  [also labelled W21_GPIO_IO27]  [project net EXP_GPIO_IO27]
GPIO_IO28: U101.W20(GPIO_IO28) ; off-sheet W20_GPIO_IO28  [also labelled W20_GPIO_IO28]
GPIO_IO29: U101.Y21(GPIO_IO29) ; off-sheet Y21_GPIO_IO29  [also labelled Y21_GPIO_IO29]
H21_SAI1_TXD0: U101.H21(SAI1_TXD0) ; off-sheet H21_SAI1_TXD0  [also labelled SAI1_TXD0]  [project net #BOOT_MODE3]
I2C1_SCL: U101.C20(I2C1_SCL) ; off-sheet C20_I2C1_SCL  [also labelled C20_I2C1_SCL]
I2C1_SDA: U101.C21(I2C1_SDA) ; off-sheet C21_I2C1_SDA  [also labelled C21_I2C1_SDA]
I2C2_SCL: R2579.2 U101.D20(I2C2_SCL) ; off-sheet D20_I2C2_SCL  [also labelled D20_I2C2_SCL]
I2C2_SDA: R2580.2 U101.D21(I2C2_SDA) ; off-sheet D21_I2C2_SDA  [also labelled D21_I2C2_SDA]
LVDS_CLK_N: U101.A3(LVDS_CLK_N) ; off-sheet A3_LVDS_CLK_N  [also labelled A3_LVDS_CLK_N]
LVDS_CLK_P: U101.B3(LVDS_CLK_P) ; off-sheet B3_LVDS_CLK_P  [also labelled B3_LVDS_CLK_P]
LVDS_TX0_N: U101.A5(LVDS_D0_N) ; off-sheet A5_LVDS_D0_N  [also labelled A5_LVDS_D0_N]
LVDS_TX0_P: U101.B5(LVDS_D0_P) ; off-sheet B5_LVDS_D0_P  [also labelled B5_LVDS_D0_P]
LVDS_TX1_N: U101.A4(LVDS_D1_N) ; off-sheet A4_LVDS_D1_N  [also labelled A4_LVDS_D1_N]
LVDS_TX1_P: U101.B4(LVDS_D1_P) ; off-sheet B4_LVDS_D1_P  [also labelled B4_LVDS_D1_P]
LVDS_TX2_N: U101.A2(LVDS_D2_N) ; off-sheet A2_LVDS_D2_N  [also labelled A2_LVDS_D2_N]
LVDS_TX2_P: U101.B2(LVDS_D2_P) ; off-sheet B2_LVDS_D2_P  [also labelled B2_LVDS_D2_P]
LVDS_TX3_N: U101.B1(LVDS_D3_N) ; off-sheet B1_LVDS_D3_N  [also labelled B1_LVDS_D3_N]
LVDS_TX3_P: U101.C1(LVDS_D3_P) ; off-sheet C1_LVDS_D3_P  [also labelled C1_LVDS_D3_P]
PDM_CLK: U101.G17(PDM_CLK) ; off-sheet G17_PDM_CLK  [also labelled G17_PDM_CLK]
PDM_DATA0: U101.J17(PDM_BIT_STREAM0) ; off-sheet J17_PDM_DATA0  [also labelled J17_PDM_DATA0]
PDM_DATA1: R806.2 U101.G18(PDM_BIT_STREAM1) ; off-sheet G18_PDM_DATA1  [also labelled G18_PDM_DATA1]
PMIC_nINT: R806.1 ; off-sheet PMIC_nINT
SAI1_RXD0: U101.H20(SAI1_RXD0) ; off-sheet H20_SAI1_RXD0  [also labelled H20_SAI1_RXD0]
SAI1_TXC: U101.G20(SAI1_TXC) ; off-sheet G20_SAI1_TXC  [also labelled G20_SAI1_TXC]
SD1_CLK: U101.Y11(SD1_CLK) ; off-sheet Y11_SD1_CLK  [also labelled Y11_SD1_CLK]
SD1_CMD: U101.AA12(SD1_CMD) ; off-sheet AA12_SD1_CMD  [also labelled AA12_SD1_CMD]
SD1_DATA0: U101.AA14(SD1_DATA0) ; off-sheet AA14_SD1_DATA0  [also labelled AA14_SD1_DATA0]
SD1_DATA1: U101.AA15(SD1_DATA1) ; off-sheet AA15_SD1_DATA1  [also labelled AA15_SD1_DATA1]
SD1_DATA2: U101.AA16(SD1_DATA2) ; off-sheet AA16_SD1_DATA2  [also labelled AA16_SD1_DATA2]
SD1_DATA3: U101.AA13(SD1_DATA3) ; off-sheet AA13_SD1_DATA3  [also labelled AA13_SD1_DATA3]
SD1_DATA4: U101.Y13(SD1_DATA4) ; off-sheet Y13_SD1_DATA4  [also labelled Y13_SD1_DATA4]
SD1_DATA5: U101.Y14(SD1_DATA5) ; off-sheet Y14_SD1_DATA5  [also labelled Y14_SD1_DATA5]
SD1_DATA6: U101.Y15(SD1_DATA6) ; off-sheet Y15_SD1_DATA6  [also labelled Y15_SD1_DATA6]
SD1_DATA7: U101.Y16(SD1_DATA7) ; off-sheet Y16_SD1_DATA7  [also labelled Y16_SD1_DATA7]
SD1_STROBE: U101.Y12(SD1_STROBE) ; off-sheet Y12_SD1_STROBE  [also labelled Y12_SD1_STROBE]
SD2_CLK: U101.AA19(SD2_CLK) ; off-sheet AA19_SD2_CLK  [also labelled AA19_SD2_CLK]
SD2_CMD: R311.2 U101.Y19(SD2_CMD) ; off-sheet Y19_SD2_CMD  [also labelled Y19_SD2_CMD]
SD2_DATA0: R310.2 U101.Y18(SD2_DATA0) ; off-sheet Y18_SD2_DATA0  [also labelled Y18_SD2_DATA0]
SD2_DATA1: U101.AA18(SD2_DATA1) ; off-sheet AA18_SD2_DATA1  [also labelled AA18_SD2_DATA1]
SD2_DATA2: U101.Y20(SD2_DATA2) ; off-sheet Y20_SD2_DATA2  [also labelled Y20_SD2_DATA2]
SD2_DATA3: U101.AA20(SD2_DATA3) ; off-sheet AA20_SD2_DATA3  [also labelled AA20_SD2_DATA3]
SD2_nCD: U101.Y17(SD2_CD_B) ; off-sheet Y17_SD2_nCD  [also labelled Y17_SD2_nCD]
SD2_RESET_B: R312.2 U101.AA17(SD2_RESET_B) ; off-sheet AA17_SD2_RESET_B  [also labelled AA17_SD2_RESET_B]
SD2_VSEL: U101.V18(SD2_VSELECT) ; off-sheet V18_SD2_VSELECT  [also labelled V18_SD2_VSELECT]
SD3_CLK: U101.V16(SD3_CLK) ; off-sheet V16_SD3_CLK  [also labelled V16_SD3_CLK]
SD3_CMD: U101.U16(SD3_CMD) ; off-sheet U16_SD3_CMD  [also labelled U16_SD3_CMD]
SD3_DATA0: U101.T16(SD3_DATA0) ; off-sheet T16_SD3_DATA0  [also labelled T16_SD3_DATA0]
SD3_DATA1: U101.V14(SD3_DATA1) ; off-sheet V14_SD3_DATA1  [also labelled V14_SD3_DATA1]
SD3_DATA2: U101.U14(SD3_DATA2) ; off-sheet U14_SD3_DATA2  [also labelled U14_SD3_DATA2]
SD3_DATA3: U101.T14(SD3_DATA3) ; off-sheet T14_SD3_DATA3  [also labelled T14_SD3_DATA3]
UART1_RXD: U101.E20(UART1_RXD) ; off-sheet E20_UART1_RXD  [also labelled E20_UART1_RXD]
UART2_RXD: U101.F20(UART2_RXD) ; off-sheet F20_UART2_RXD  [also labelled F20_UART2_RXD]
USB1_DP: U101.B14(USB1_D_P) ; off-sheet B14_USB1_D_P  [also labelled B14_USB1_D_P]
USB1_ID: U101.C11(USB1_ID) ; off-sheet C11_USB1_ID  [also labelled C11_USB1_ID]
USB2_DN: U101.A15(USB2_D_N) ; off-sheet A15_USB2_D_N  [also labelled A15_USB2_D_N]
USB2_DP: U101.B15(USB2_D_P) ; off-sheet B15_USB2_D_P  [also labelled B15_USB2_D_P]
USB2_ID: U101.E12(USB2_ID) ; off-sheet E12_USB2_ID  [also labelled E12_USB2_ID]
VBUS1_DET_3V3: R301.1 U101.F12(USB1_VBUS)
VBUS2_DET_3V3: R304.1 U101.E14(USB2_VBUS)
WDOG_B: U101.J18(WDOG_ANY) ; off-sheet J18_WDOG_B  [also labelled J18_WDOG_B]
NetR302_2: R302.2 U101.D8(MIPI_REXT)
NetR303_1: R303.1 U101.D12(USB1_TXRTUNE)
NetR305_1: R305.1 U101.D14(USB2_TXRTUNE)
NetR816_2: R816.2 U10.1(A0) U10.2(A1) U10.3(A2)
NetR2579_1: R2579.1 U10.6(SCL)
NetR2580_1: R2580.1 U10.5(SDA)

Not connected (* = marked no-connect by the designer): U101 A12(NC_A12)* A13(NC_A13)* B12(NC_B12)* B13(NC_B13)*

### Layout directives
differential pair: CSI_CLK_N, CSI_CLK_P, CSI_D0_N, CSI_D0_P, CSI_D1_N, CSI_D1_P, DSI_CLK_N, DSI_CLK_P, DSI_D0_N, DSI_D0_P, DSI_D1_N, DSI_D1_P, DSI_D2_N, DSI_D2_P, DSI_D3_N, DSI_D3_P, LVDS_CLK_N, LVDS_CLK_P, LVDS_TX0_N, LVDS_TX0_P, LVDS_TX1_N, LVDS_TX1_P, LVDS_TX2_N, LVDS_TX2_P, LVDS_TX3_N, LVDS_TX3_P, USB1_DM, USB1_DP, USB2_DN, USB2_DP

### Notes on the sheet
- i.MX93 IO/PHY
- (near R312) External PU is necessary for SD2_RESET_B to enable SD card power as default!
- (near U101) DSI Z:100 OHM
- (near U101) LVDS Z:100 OHM
- #eMMC
- (near U101) #ENET1
- (near U101) #MIPI DSI LCD
- (near U101) #LVDS LCD
- #M.2
- (near U101) #ENET2
- #MIPI CSI CAM
- (near U101) USB Z:90 OHM
- #USB2 HOST
- (near U101) #MicroSD
- #USB1 C DRP
- (near U101) PHY
- (near U101) #EXP 40P
- I2C device address 1010000RW,0x50
- EEPROM
- DWG. NO.
- REV.
- SHT.
- REVISION
- DESCRIPTION
- DATE
- APPROVED
- ENG:
- APPROVALS
- quilter.ai <http://quilter.ai>
- DSN:
- CHK:
- REFERENCE DOCUMENTS
- TITLE
- PROJECT
- BOM:
- FAB DWG:
- PCB DWG:
- ASSY DWG:
- SIZE
- FILE NAME
- C
- DWG NO.
- SHEET
- OF
- REV
- (in symbol MIMX9352DVNxLAA, part B) NVCC_GPIO
- (in symbol MIMX9352DVNxLAA, part C) NVCC_WAKEUP
- (in symbol MIMX9352DVNxLAA, part D) MIPI_DSI_VPH; USB2_VDD33; MIPI_CSI_VPH; USB1_VDD33; ONLY FOR i.MX95
- (in symbol TitleBlock_MCPG) Microcontroller Product Group; 6501 William Cannon Drive West / Austin, TX 78735-8598; This document contains information proprietary to NXP and shall not be used for engineering design,; procurement or manufacture in whole or in part without the express written permission of NXP Semiconductors.; ©; NXP SEMICONDUCTORS; Classification:; Designer:; Drawing Title:; Drawn by:; Page Title:; Approved:; Size; Document Number; Rev; Date:; Sheet; of

### Library data of the parts
*#6 = TitleBlock_MCPG: Classification: Public, Company Internal/Proprietary, Company Confidential,  Company Secret; OrgName: NXP Semiconductor; OrgAddr1: NO. 192 Liangjing Rd. Pudong New Area, ShangHai; Page Size: =PageSize; Page Create Date: March  8, 1995; Designer: FORLINX; Page Modify Date: =ModifiedDate
C815 = CAP_NP: 0402,100nF,50V,+/-10%,X5R; Part Reference: C815; CLASS: DISCRETE; MFG_PN01: 0402X104K500NT; MFG_NAME01: FENGHUA; CAD_APPROVED: Yes; Tolerance: 10%; FPLIST: CC0402_25,CC0402_HD,0402_CC,capc0402_l; Value: 100nF; ROHS: Yes; HEIGHT: 0.55 MM; PCB Footprint: C0402
R301 = RES: 0201,0Ohm,+/-5%; Part Reference: R301; CLASS: DISCRETE; FPLIST: RC0201,0201_CC,RC0201_X2; CAD_APPROVED: Yes; MFG_PN01: RC-01000JT; MFG_NAME01: FENGHUA; Value: 0R; HEIGHT: 0.30 MM; ROHS: Yes; PCB Footprint: R0201
R302 = RES: 0201,200Ohm,+/-1%; Part Reference: R302; CLASS: DISCRETE; Temp Range: -55¡ãC ~ 125¡ãC; VOLTAGE: 25V; MFG_NAME01: FENGHUA; MFG_PN01: RC-01W2000FT; CAD_APPROVED: Yes; FPLIST: RC0201,0201_CC; Value: 200R; ROHS: Yes; Temp_Range: -55¡ãC ~ 125¡ãC; HEIGHT: 0.26MM; PCB Footprint: R0201
R303 = RES: 0201,200Ohm,+/-1%; Part Reference: R303; CLASS: DISCRETE; FPLIST: RC0201,0201_CC; CAD_APPROVED: Yes; Temp_Range: -55¡ãC ~ 125¡ãC; MFG_PN01: RC-01W2000FT; MFG_NAME01: FENGHUA; VOLTAGE: 25V; Value: 200R; HEIGHT: 0.26MM; ROHS: Yes; Temp Range: -55¡ãC ~ 125¡ãC; PCB Footprint: R0201
R304 = RES: 0201,0Ohm,+/-5%; Part Reference: R304; CLASS: DISCRETE; MFG_NAME01: FENGHUA; MFG_PN01: RC-01000JT; CAD_APPROVED: Yes; FPLIST: RC0201,0201_CC,RC0201_X2; Value: 0R; ROHS: Yes; HEIGHT: 0.30 MM; PCB Footprint: R0201
R305 = RES: 0201,200Ohm,+/-1%; Part Reference: R305; CLASS: DISCRETE; FPLIST: RC0201,0201_CC; CAD_APPROVED: Yes; Temp_Range: -55¡ãC ~ 125¡ãC; MFG_PN01: RC-01W2000FT; MFG_NAME01: FENGHUA; VOLTAGE: 25V; Value: 200R; HEIGHT: 0.26MM; ROHS: Yes; Temp Range: -55¡ãC ~ 125¡ãC; PCB Footprint: R0201
R310 = RES: 0402,10K,+/-1%; Part Reference: R310; CLASS: DISCRETE; FPLIST: RC0402_25,RC0402_HD,0402_CC; CAD_APPROVED: Yes; MFG_PN01: RC-02W1002FT; MFG_NAME01: FENGHUA; Tolerance: 5%; Value: 10K; HEIGHT: 0.4 MM; ROHS: Yes; PCB Footprint: R0402
R311 = RES: 0402,10K,+/-1%; Part Reference: R311; CLASS: DISCRETE; Tolerance: 5%; MFG_NAME01: FENGHUA; MFG_PN01: RC-02W1002FT; CAD_APPROVED: Yes; FPLIST: RC0402_25,RC0402_HD,0402_CC; Value: 10K; ROHS: Yes; HEIGHT: 0.4 MM; PCB Footprint: R0402
R312 = RES: 0402,4.7K,+/-1%; Part Reference: R312; CLASS: DISCRETE; Temp Range: -55C to +155C; Tolerance: 5%; MFG_NAME01: FENGHUA; MFG_PN01: RC-02K4701FT; CAD_APPROVED: Yes; FPLIST: RC0402_25,RC0402_HD,0402_CC,RC0402_X2; VOLTAGE: 50V; Value: 4.7K; ROHS: Yes; Temp_Range: -55C to +155C; HEIGHT: 0.41mm; PCB Footprint: R0402
R806 = RES: 0201,0Ohm,+/-5%; Part Reference: R806; CLASS: DISCRETE; MFG_NAME01: FENGHUA; MFG_PN01: RC-01000JT; CAD_APPROVED: Yes; FPLIST: RC0201,0201_CC,RC0201_X2; Value: 0R; ROHS: Yes; HEIGHT: 0.30 MM; PCB Footprint: R0201
R816 = RES: 0402,1K,+/-1%; Part Reference: R816; CLASS: DISCRETE; MFG_NAME01: FENGHUA; MFG_PN01: RC-02K1001FT; CAD_APPROVED: Yes; FPLIST: RC0402_25,RC0402_HD,0402_CC; Value: 1K; ROHS: Yes; HEIGHT: 0.4 MM; PCB Footprint: R0402
R2579 = RES: 0402,0Ohm,+/-1%; Part Reference: R2579; CLASS: DISCRETE; VOLTAGE: 1/16W; FPLIST: RC0402_25,RC0402_HD,RC0402_X2,0402_CC; CAD_APPROVED: Yes; MFG_PN01: RC-02000FT; MFG_NAME01: FENGHUA; Tolerance: 5%; Value: 0R; HEIGHT: 0.45 MM; ROHS: Yes; PCB Footprint: R0402
R2580 = RES: 0402,0Ohm,+/-1%; Part Reference: R2580; CLASS: DISCRETE; Tolerance: 5%; MFG_NAME01: FENGHUA; MFG_PN01: RC-02000FT; CAD_APPROVED: Yes; FPLIST: RC0402_25,RC0402_HD,RC0402_X2,0402_CC; VOLTAGE: 1/16W; Value: 0R; ROHS: Yes; HEIGHT: 0.45 MM; PCB Footprint: R0402
U10 = AT24C64D-MA9M_0: FT24C256A-ENR-T,UDFN8; Part Reference: U10; MFG_NAME01: ONSEMI; Value: AT24C256D_MAHM_T; MFG_PN01: FT24C256A-ENR-T; PCB Footprint: UDFN-8P
U101 = MIMX9352DVNxLAA: MIMX9352CVVXMAB,-40~105+C,11*11mm,0.5mm pitch,FCBGA,A,306pin,1.7GHz; Part Reference: U101; CLASS: IC; MFG_NAME01: NXP SEMICONDUCTORS; CAD_APPROVED: Yes; FPLIST: skt_bga306_0p5_sq16p23_elast,skt_bga306_0p5_sq16p23_elast_nsp; Value: SKT BGA 306 + MIMX9352DVNxLAA; MFG_PN01: MIMX9352DVNxLAA; ROHS: Yes; HEIGHT: 10.03MM; PCB Footprint: skt_bga306_0p5_sq16p23_elast_nsp